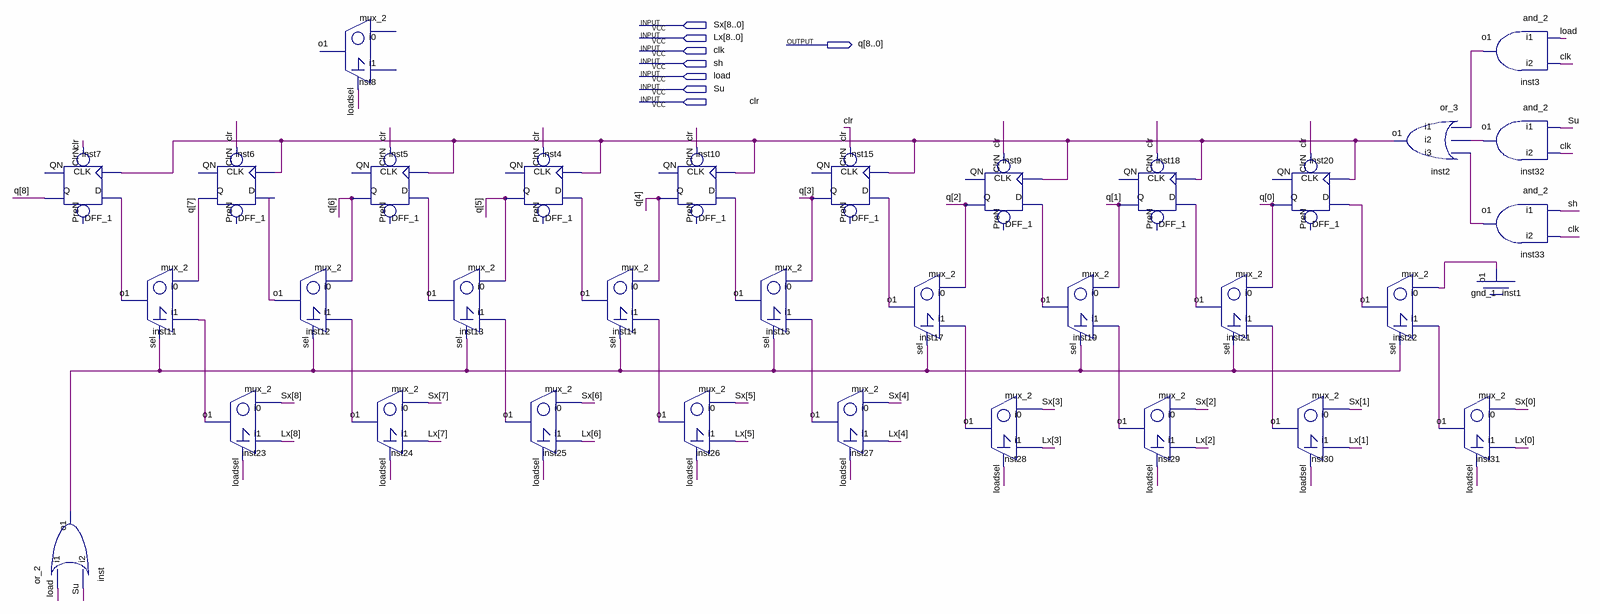
[diagram p0: schematic sheet]
// Quartus schematic register.bdf as structural Verilog: 34 symbols, 8 pins
module register (
  input  [8:0] Sx,
  input  [8:0] Lx,
  input  clk,
  input  sh,
  input  load,
  input  Su,
  input  clr,
  output [8:0] q
);

  wire inst1_o1, inst2_o1, inst3_o1, inst11_o1, inst12_o1, inst13_o1, inst14_o1, inst16_o1, inst17_o1,
       inst19_o1, inst21_o1, inst22_o1, inst23_o1, inst24_o1, inst25_o1, inst26_o1, inst27_o1, inst28_o1,
       inst29_o1, inst30_o1, inst31_o1, inst32_o1, inst33_o1, inst_o1;

  DFF_1 inst7 (.CLK(inst2_o1), .D(inst11_o1), .ClrN(clr), .Q(q[8]));  // open: PreN, QN
  or_2 inst (.i1(load), .i2(Su), .o1(inst_o1));
  mux_2 inst11 (.sel(inst_o1), .i0(q[7]), .i1(inst23_o1), .o1(inst11_o1));
  DFF_1 inst6 (.CLK(inst2_o1), .D(inst12_o1), .ClrN(clr), .Q(q[7]));  // open: PreN, QN
  mux_2 inst23 (.sel(load), .i0(Sx[8]), .i1(Lx[8]), .o1(inst23_o1));
  mux_2 inst12 (.sel(inst_o1), .i0(q[6]), .i1(inst24_o1), .o1(inst12_o1));
  mux_2 inst8 (.sel(load));  // open: i0, i1, o1
  DFF_1 inst5 (.CLK(inst2_o1), .D(inst13_o1), .ClrN(clr), .Q(q[6]));  // open: PreN, QN
  mux_2 inst24 (.sel(load), .i0(Sx[7]), .i1(Lx[7]), .o1(inst24_o1));
  mux_2 inst13 (.sel(inst_o1), .i0(q[5]), .i1(inst25_o1), .o1(inst13_o1));
  DFF_1 inst4 (.CLK(inst2_o1), .D(inst14_o1), .ClrN(clr), .Q(q[5]));  // open: PreN, QN
  mux_2 inst25 (.sel(load), .i0(Sx[6]), .i1(Lx[6]), .o1(inst25_o1));
  mux_2 inst14 (.sel(inst_o1), .i0(q[4]), .i1(inst26_o1), .o1(inst14_o1));
  DFF_1 inst10 (.CLK(inst2_o1), .D(inst16_o1), .ClrN(clr), .Q(q[4]));  // open: PreN, QN
  mux_2 inst26 (.sel(load), .i0(Sx[5]), .i1(Lx[5]), .o1(inst26_o1));
  mux_2 inst16 (.sel(inst_o1), .i0(q[3]), .i1(inst27_o1), .o1(inst16_o1));
  DFF_1 inst15 (.CLK(inst2_o1), .D(inst17_o1), .ClrN(clr), .Q(q[3]));  // open: PreN, QN
  mux_2 inst27 (.sel(load), .i0(Sx[4]), .i1(Lx[4]), .o1(inst27_o1));
  mux_2 inst17 (.sel(inst_o1), .i0(q[2]), .i1(inst28_o1), .o1(inst17_o1));
  DFF_1 inst9 (.CLK(inst2_o1), .D(inst19_o1), .ClrN(clr), .Q(q[2]));  // open: PreN, QN
  mux_2 inst28 (.sel(load), .i0(Sx[3]), .i1(Lx[3]), .o1(inst28_o1));
  mux_2 inst19 (.sel(inst_o1), .i0(q[1]), .i1(inst29_o1), .o1(inst19_o1));
  DFF_1 inst18 (.CLK(inst2_o1), .D(inst21_o1), .ClrN(clr), .Q(q[1]));  // open: PreN, QN
  mux_2 inst29 (.sel(load), .i0(Sx[2]), .i1(Lx[2]), .o1(inst29_o1));
  mux_2 inst21 (.sel(inst_o1), .i0(q[0]), .i1(inst30_o1), .o1(inst21_o1));
  DFF_1 inst20 (.CLK(inst2_o1), .D(inst22_o1), .ClrN(clr), .Q(q[0]));  // open: PreN, QN
  mux_2 inst30 (.sel(load), .i0(Sx[1]), .i1(Lx[1]), .o1(inst30_o1));
  or_3 inst2 (.i1(inst3_o1), .i2(inst32_o1), .i3(inst33_o1), .o1(inst2_o1));
  mux_2 inst22 (.sel(inst_o1), .i0(inst1_o1), .i1(inst31_o1), .o1(inst22_o1));
  mux_2 inst31 (.sel(load), .i0(Sx[0]), .i1(Lx[0]), .o1(inst31_o1));
  and_2 inst3 (.i1(load), .i2(clk), .o1(inst3_o1));
  and_2 inst32 (.i1(Su), .i2(clk), .o1(inst32_o1));
  and_2 inst33 (.i1(sh), .i2(clk), .o1(inst33_o1));
  gnd_1 inst1 (.o1(inst1_o1));
endmodule
